# EAGLE design MC33079DG_Breakout (EAGLE 9.6.2)
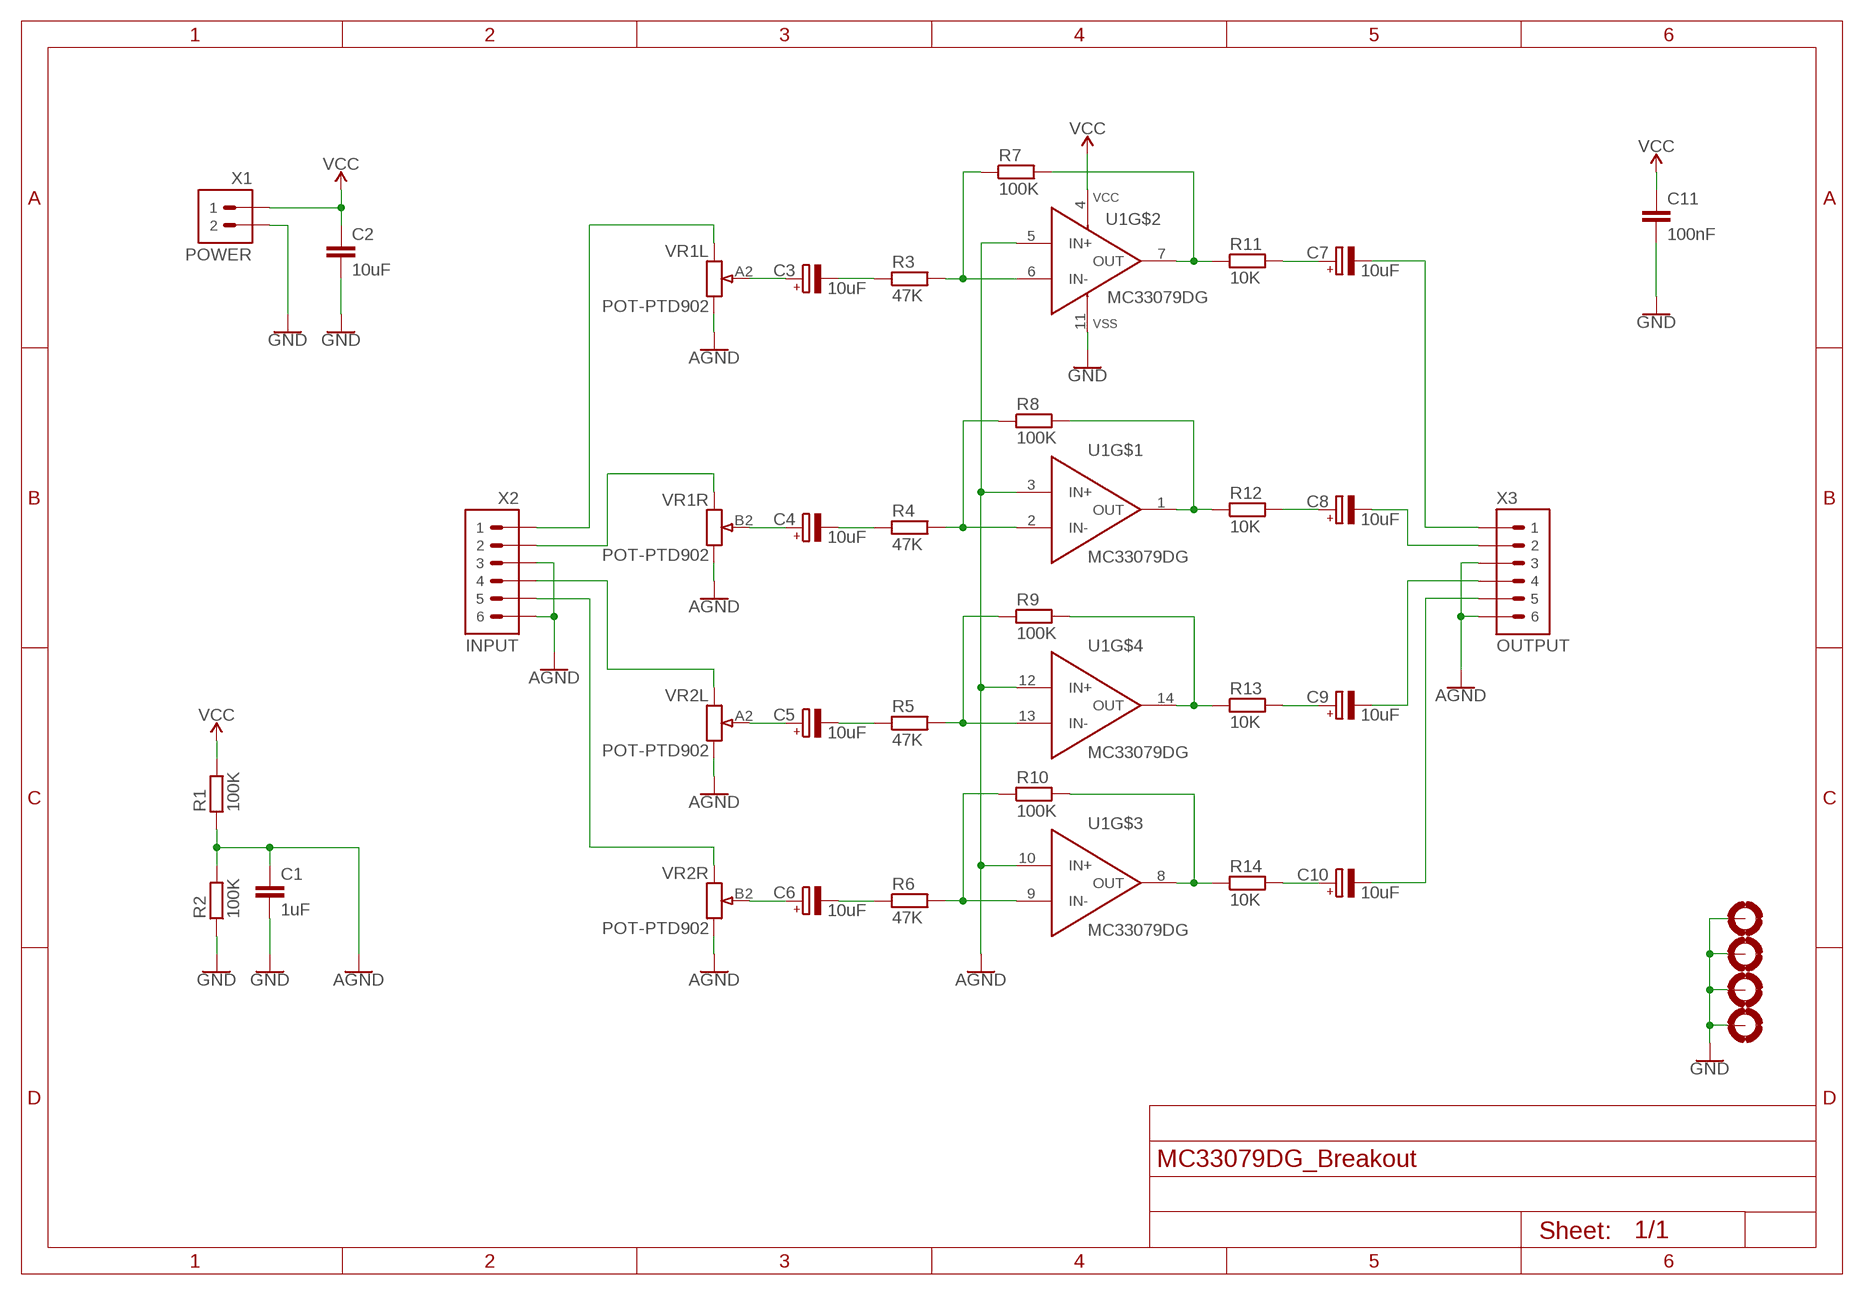
[diagram p0: schematic, sheet 1]

## Parts
C1  1uF  CAPC0603  [C0603]
C2  10uF  CAPC0603  [C0603]
C3  10uF  CAP-POL-ALUMROQANG-RVT0405  [ROQANG-RVT0405]
C4  10uF  CAP-POL-ALUMROQANG-RVT0405  [ROQANG-RVT0405]
C5  10uF  CAP-POL-ALUMROQANG-RVT0405  [ROQANG-RVT0405]
C6  10uF  CAP-POL-ALUMROQANG-RVT0405  [ROQANG-RVT0405]
C7  10uF  CAP-POL-ALUMROQANG-RVT0405  [ROQANG-RVT0405]
C8  10uF  CAP-POL-ALUMROQANG-RVT0405  [ROQANG-RVT0405]
C9  10uF  CAP-POL-ALUMROQANG-RVT0405  [ROQANG-RVT0405]
C10  10uF  CAP-POL-ALUMROQANG-RVT0405  [ROQANG-RVT0405]
C11  100nF  CAPC0603  [C0603]
H1  MOUNTHOLE-PAD3.2  [3.2-PAD]
H2  MOUNTHOLE-PAD3.2  [3.2-PAD]
H3  MOUNTHOLE-PAD3.2  [3.2-PAD]
H4  MOUNTHOLE-PAD3.2  [3.2-PAD]
R1  100K  RESISTOR0603  [R0603]
R2  100K  RESISTOR0603  [R0603]
R3  47K  RESISTOR0603  [R0603]
R4  47K  RESISTOR0603  [R0603]
R5  47K  RESISTOR0603  [R0603]
R6  47K  RESISTOR0603  [R0603]
R7  100K  RESISTOR0603  [R0603]
R8  100K  RESISTOR0603  [R0603]
R9  100K  RESISTOR0603  [R0603]
R10  100K  RESISTOR0603  [R0603]
R11  10K  RESISTOR0603  [R0603]
R12  10K  RESISTOR0603  [R0603]
R13  10K  RESISTOR0603  [R0603]
R14  10K  RESISTOR0603  [R0603]
U1  MC33079DG  OPAMP-MC33079DG  [SOIC-14]
VR1  POT-PTD902  [POT-PTD902]
VR2  POT-PTD902  [POT-PTD902]
X1  POWER  HEADER-1X02-2.54POL  [1X02P-2.54]
X2  INPUT  HEADER-1X06-2.54  [1X06-2.54]
X3  OUTPUT  HEADER-1X06-2.54  [1X06-2.54]

## Nets
AGND: C1.1 R1.1 R2.2 U1.3(IN+) U1.5(IN+) U1.10(IN+) U1.12(IN+) VR1.A1 VR1.B1 VR2.A1 VR2.B1 X2.3 X2.6 X3.3 X3.6
GND: C1.2 C2.2 C11.2 H1.B3,2(MOUNT) H2.B3,2(MOUNT) H3.B3,2(MOUNT) H4.B3,2(MOUNT) R2.1 U1.11(VSS) X1.2
N$1: C3.- R3.1
N$2: R8.2 R12.1 U1.1(OUT)
N$3: C7.+ R11.2
N$4: C8.+ R12.2
N$5: R4.2 R8.1 U1.2(IN-)
N$6: R6.2 R10.1 U1.9(IN-)
N$7: R7.2 R11.1 U1.7(OUT)
N$8: R3.2 R7.1 U1.6(IN-)
N$9: C3.+ VR1.A2
N$10: C4.- R4.1
N$11: C4.+ VR1.B2
N$12: C5.+ VR2.A2
N$13: C6.+ VR2.B2
N$14: R5.2 R9.1 U1.13(IN-)
N$15: R9.2 R13.1 U1.14(OUT)
N$16: R10.2 R14.1 U1.8(OUT)
N$17: C10.+ R14.2
N$18: C9.+ R13.2
N$19: VR1.A3 X2.1
N$20: VR1.B3 X2.2
N$21: VR2.A3 X2.4
N$22: VR2.B3 X2.5
N$23: C7.- X3.1
N$24: C8.- X3.2
N$25: C9.- X3.4
N$26: C10.- X3.5
N$27: C5.- R5.1
N$28: C6.- R6.1
VCC: C2.1 C11.1 R1.2 U1.4(VCC) X1.1

## Library data of the parts
C1 C2 C11 = M2M-Passives:CAP
C3-C10 = M2M-Passives:CAP-POL-ALUM
H1-H4 = M2M-Holes:MOUNTHOLE-PAD
R1-R14 = M2M-Passives:RESISTOR
U1 = M2M-IC:OPAMP-MC33079DG
VR1 VR2 = M2M-Passives:POT-PTD902
X1 = M2M-Connectors:HEADER-1X02-2.54
X2 X3 = M2M-Connectors:HEADER-1X06-2.54

## Board
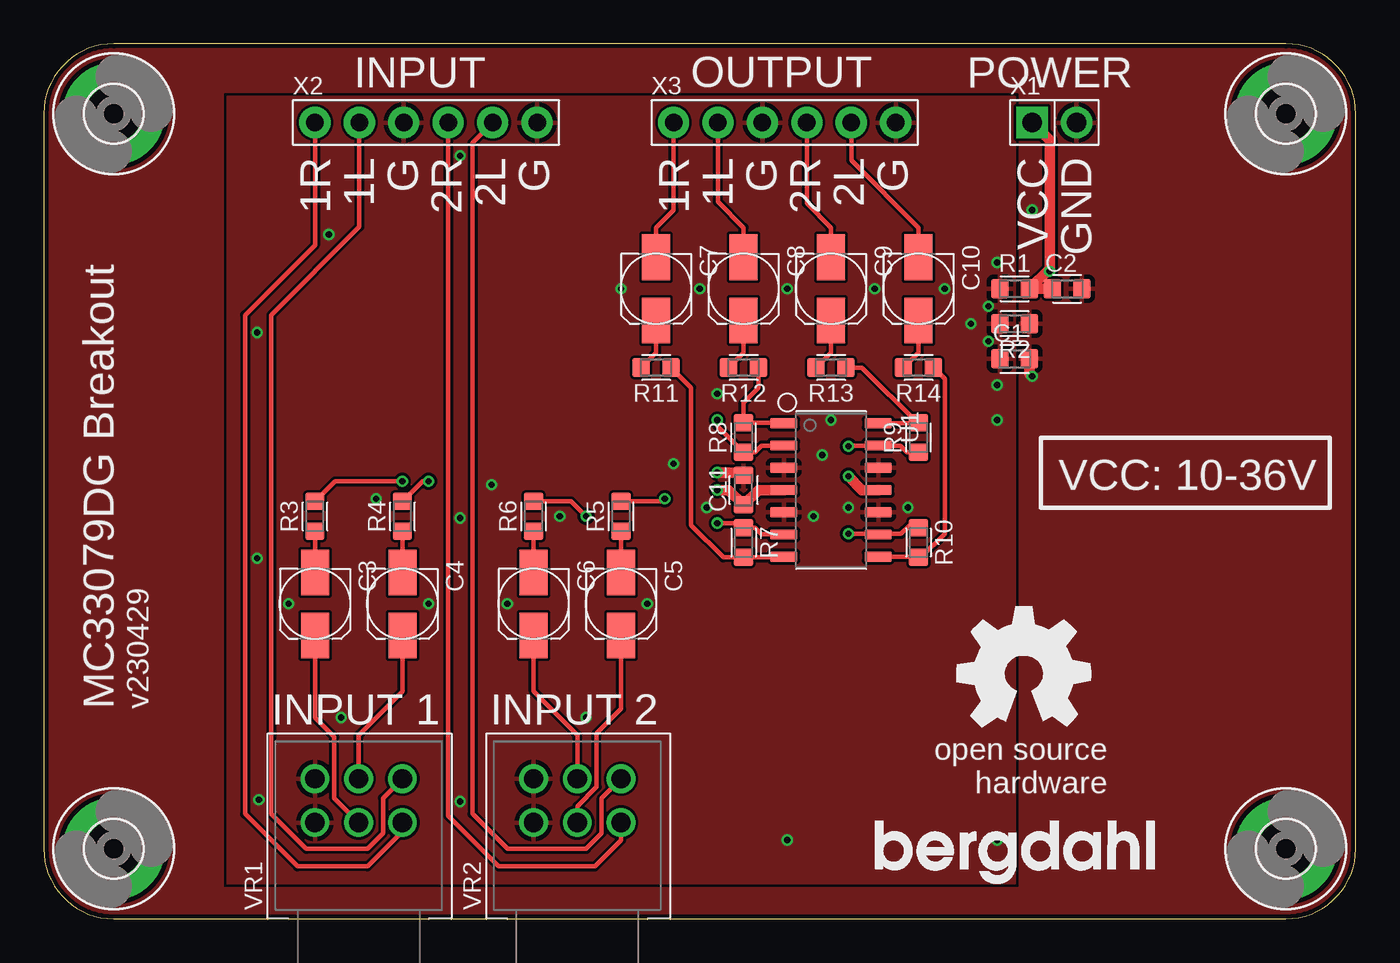
[diagram p1: board, top side]
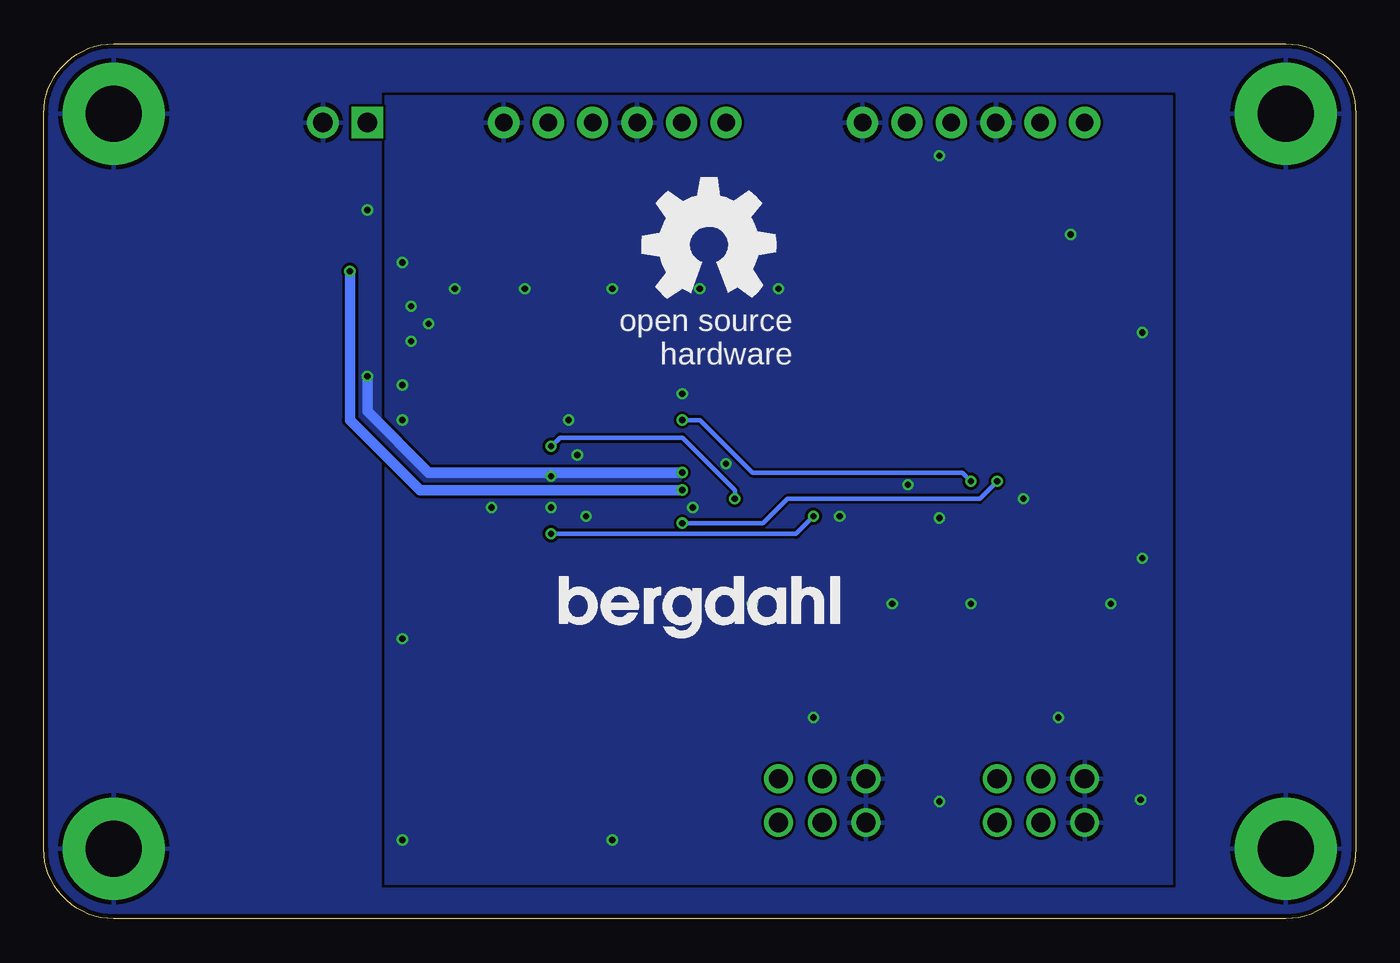
[diagram p2: board, bottom side, seen from below]

Size 75 x 50 mm. Coordinates in mm from the lower left corner, seen from the top.
Outline: 0,46 0,4 arc90 4,0 71,0 arc90 75,4 75,46 arc90 71,50 4,50 arc90 0,46
Copper layers (1*16): Top 0.035mm / dielectric 1.5mm / Bottom 0.035mm
Design rules "SeeedStudio_2layer_DRU_no_angle_20140221": minimum track width 6mil, minimum drill 0.3mm, track to track 6mil, track to pad 6mil, pad to pad 6mil, via to via 6mil, smd to smd 0mil, copper to edge 10mil, drill to drill 10mil, minimum pad ring 2mil, minimum via ring 6mil, stop-mask expansion 2mil, vias tented up to drill 1000mil, thermal gap 10mil

### Footprints (pad centres in the part's own frame; a part is rotated, then mirrored left to right if it is on the bottom)
C0603 = smd 1 x 1.1: 1 -0.85,0; 2 0.85,0
ROQANG-RVT0405 = smd 1.6 x 2.6: + 0,1.8; - 0,-1.8
3.2-PAD = drill 3.2 pad 5.842: B3,2 0,0
R0603 = smd 1 x 1.1: 1 -0.85,0; 2 0.85,0
SOIC-14 = smd 0.6 x 1.55: 1 -3.81,-2.7; 2 -2.54,-2.7; 3 -1.27,-2.7; 4 0,-2.7; 5 1.27,-2.7; 6 2.54,-2.7; 7 3.81,-2.7; 8 3.81,2.7; 9 2.54,2.7; 10 1.27,2.7; 11 0,2.7; 12 -1.27,2.7; 13 -2.54,2.7; 14 -3.81,2.7
POT-PTD902 = drill 1.1: A1 0,2.5; A2 0,0; A3 0,-2.5; B1 2.5,2.5; B2 2.5,0; B3 2.5,-2.5
1X02P-2.54 = drill 1.1 pad 1.778 square: 1 0,0 | drill 1.1 pad 1.778: 2 2.54,0
1X06-2.54 = drill 1 pad 1.778: 1 0,0; 2 2.54,0; 3 5.08,0; 4 7.62,0; 5 10.16,0; 6 12.7,0

### Placement (x,y rotation side)
C1  55.5,32 0 top
C2  58.5,36 0 top
C3  15.5,18 180 top
C4  20.5,18 180 top
C5  33,18 180 top
C6  28,18 180 top
C7  35,36 180 top
C8  40,36 180 top
C9  45,36 180 top
C10  50,36 180 top
C11  40,24.5 90 top
H1  4,4 0 top
H2  4,46 0 top
H3  71,46 0 top
H4  71,4 0 top
R1  55.5,36 0 top
R2  55.5,34 180 top
R3  15.5,23 90 top
R4  20.5,23 90 top
R5  33,23 90 top
R6  28,23 90 top
R7  40,21.5 270 top
R8  40,27.5 90 top
R9  50,27.5 90 top
R10  50,21.5 270 top
R11  35,31.5 180 top
R12  40,31.5 180 top
R13  45,31.5 180 top
R14  50,31.5 180 top
U1  45,24.5 270 top
U$1  [BERGDAHL-20MM-BPLACE]  29.5,16 0 top
U$2  [OSHW-8MM-BPLACE]  37,38.5 0 top
U$3  [BERGDAHL-20MM-TPLACE]  47.5,2 0 top
U$5  [OSHW-8MM-TPLACE]  56,14 0 top
VR1  18,5.5 90 top
VR2  30.5,5.5 90 top
X1  56.5,45.5 0 top
X2  15.5,45.5 0 top
X3  36,45.5 0 top

### Tracks (layer width: path | path; a pad name or v marks a point on that pad's centre or on a via)
AGND  (via drill 0.35)
  other vias: 54.5,4.5 42.5,4.5 54.5,16 54.5,28.5 54,33 54,35 54.5,37.5 53,34 54.5,30.5 46,23.5 44,23 44.5,26.5 31,11.5 17,11.5 19,24 29.5,23 34.5,18 26.5,18 22,18 14,18 51.5,36 47.5,36 42.5,36 37.5,36 33,36 45,28.5 38.5,30 36,26 23.8,22.9 23.8,6.7 23.8,43.6 16.3,39.1 12.3,6.8 12.2,33.5 12.2,20.6 25.6,24.8 37.9,23.5 49.4,23.5
  pour Bottom (rank 4): 10.5,47 55.5,47 55.5,2 10.5,2
  pour Top (rank 4): 10.5,47 55.5,47 55.5,2 10.5,2
GND  (via drill 0.35)
  Top 0.61: C11.2 39.85,25.5 v38.5,25.5 | v46,25.29 46.78,24.5 U1.11 | v56.5,31 56.35,31.15 C1.2
  Bottom 0.61: v38.5,25.5 45,25.5 45.78,25.5 | 45.78,25.5 v46,25.29 | v56.5,31 56.5,29 53,25.5 45.78,25.5
  other vias: 56.5,40.5
  pour Top (rank 5): 0,50 75,50 75,0 0,0
  pour Bottom (rank 5): 0,50 75,50 75,0 0,0
N$1
  Top 0.254: R3.1 C3.-
N$2
  Top 0.254: U1.1 42.26,28.35 R8.2 40,29.5 40.85,30.35 R12.1
N$3
  Top 0.254: C7.+ 35,32.35 R11.2
N$4
  Top 0.254: C8.+ 40,32.35 R12.2
N$5  (via drill 0.35)
  Top 0.254: R4.2 21.65,25 v22,25 | U1.2 41.04,27.04 40.65,26.65 R8.1 38.5,28.15 v38.5,28.5
  Bottom 0.254: v38.5,28.5 37.5,28.5 34.5,25.5 22.5,25.5 v22,25
N$6  (via drill 0.35)
  Top 0.254: R10.1 49.85,22.5 49.5,22.5 49,22 47.74,22 U1.9 47.66,22 v46,22 | R6.2 30.15,23.85 v31,23
  Bottom 0.254: v31,23 32,22 v46,22
N$7
  Top 0.254: U1.7 42.26,20.65 R7.2 38.85,20.65 37,22.5 37,30.35 R11.1
N$8  (via drill 0.35)
  Top 0.254: R3.2 16.65,25 v20.5,25 | U1.6 41.04,21.96 40.65,22.35 R7.1 39.74,22.61 v38.5,22.61
  Bottom 0.254: v20.5,25 21.5,24 32.5,24 33.89,22.61 v38.5,22.61
N$9
  Top 0.254: VR1.A2 16.6,6.9 16.6,10.4 15.5,11.5 C3.+
N$10
  Top 0.254: R4.1 C4.-
N$11
  Top 0.254: VR1.B2 18,10.5 20.5,13 C4.+
N$12
  Top 0.254: VR2.A2 30.5,6.44 31.6,7.54 31.6,10.6 33,12 C5.+
N$13
  Top 0.254: VR2.B2 30.5,10.5 28,13 C6.+
N$14  (via drill 0.35)
  Top 0.254: R9.1 49.35,26.65 48.96,27.04 U1.13 46.04,27.04 v46,27 | R5.2 35.35,23.85 v35.5,24
  Bottom 0.254: v35.5,24 35.5,24.5 38.5,27.5 45.5,27.5 v46,27
N$15
  Top 0.254: U1.14 49.96,28.31 | 49.96,28.31 R9.2 | R13.1 46.77,31.5 49.96,28.31
N$16
  Top 0.254: U1.8 49.96,20.69 R10.2 50.15,20.65 51.5,22 51.5,30.85 R14.1
N$17
  Top 0.254: C10.+ 50,32.35 R14.2
N$18
  Top 0.254: C9.+ 45,32.35 R13.2
N$19
  Top 0.254: VR1.A3 20.5,5 18.5,3 14.5,3 11.5,6 11.5,34.5 15.5,38.5 X2.1
N$20
  Top 0.254: VR1.B3 19.4,6.9 19.4,4.9 18.5,4 15,4 13,6 13,34.5 18.04,39.54 X2.2
N$21
  Top 0.254: VR2.A3 33,4.5 31.5,3 26,3 23.12,5.88 X2.4
N$22
  Top 0.254: X2.5 24.5,44.34 24.5,6 26.5,4 31,4 31.9,4.9 31.9,6.9 VR2.B3
N$23
  Top 0.254: C7.- 35,39.5 36,40.5 X3.1
N$24
  Top 0.254: C8.- 40,39.5 38.54,40.96 X3.2
N$25
  Top 0.254: C9.- 45,39.5 43.62,40.88 X3.4
N$26
  Top 0.254: C10.- 50,39.5 46.16,43.34 X3.5
N$27
  Top 0.254: R5.1 C5.-
N$28
  Top 0.254: R6.1 C6.-
VCC  (via drill 0.35)
  Top 0.61: X1.1 57.5,44.5 v57.5,37 57.5,37.15 R1.2 C2.1 | U1.4 40.85,24.5 C11.1 39.15,24.5 v38.5,24.5
  Bottom 0.61: v57.5,37 57.5,28.5 53.5,24.5 v38.5,24.5

### Text on the board
tPlace: INPUT | OUTPUT | POWER | 1R | 1L | G | 2R | 2L | G | 1R | 1L | G | 2R | 2L | G | VCC | GND | VCC: 10-36V | MC33079DG Breakout | v230429 | INPUT 1 | INPUT 2